# EAGLE schematic Coba (EAGLE 9.6.0)
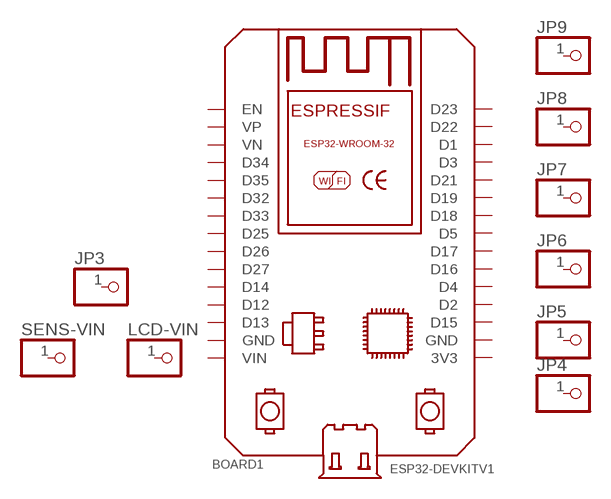
[diagram p0: schematic, sheet 1]

## Parts
BOARD1  ESP32DEVKITV1  [ESP32-DEVKITV1]
JP3  PINHD-1X1  [1X01]
JP4  PINHD-1X1  [1X01]
JP5  PINHD-1X1  [1X01]
JP6  PINHD-1X1  [1X01]
JP7  PINHD-1X1  [1X01]
JP8  PINHD-1X1  [1X01]
JP9  PINHD-1X1  [1X01]
LCD-VIN  PINHD-1X1  [1X01]
SENS-VIN  PINHD-1X1  [1X01]
Unconnected: BOARD1.3V3 BOARD1.D1 BOARD1.D2 BOARD1.D3 BOARD1.D4 BOARD1.D5 BOARD1.D12 BOARD1.D13 BOARD1.D14 BOARD1.D15 BOARD1.D16 BOARD1.D17 BOARD1.D18 BOARD1.D19 BOARD1.D21 BOARD1.D22 BOARD1.D23 BOARD1.D25 BOARD1.D26 BOARD1.D27 BOARD1.D32 BOARD1.D33 BOARD1.D34 BOARD1.D35 BOARD1.EN BOARD1.GND BOARD1.GND@1(GND) BOARD1.VIN BOARD1.VN BOARD1.VP JP3.1 JP4.1 JP5.1 JP6.1 JP7.1 JP8.1 JP9.1 LCD-VIN.1 SENS-VIN.1

## Library data of the parts
BOARD1 = ESP32-DEVKITV1:ESP32DEVKITV1: https://github.com/shridattdudhat
JP3-JP9 LCD-VIN SENS-VIN = pinhead:PINHD-1X1: PIN HEADER